# EAGLE design Teensy-Maxuino-Slave-DRV4835 (EAGLE 6.4)
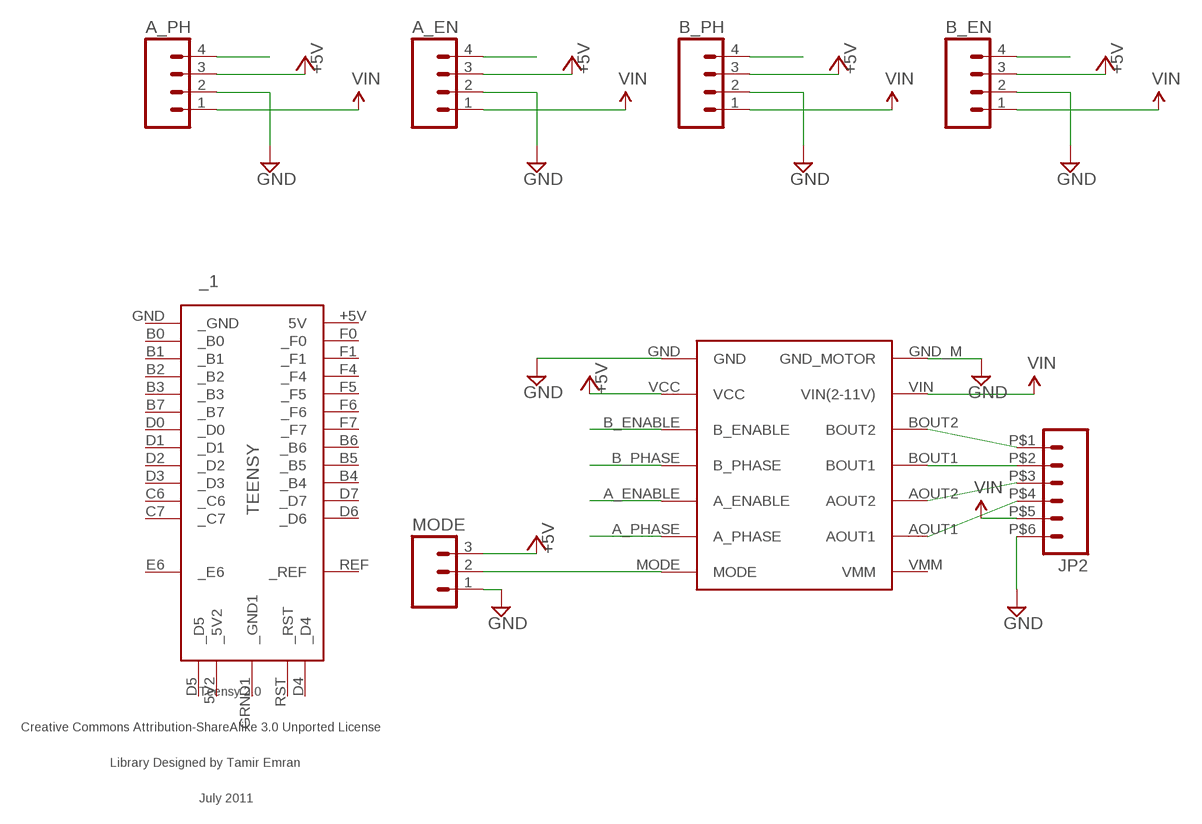
[diagram p0: schematic, sheet 1]

## Parts
_1  TEENSY  [TEENSY]
A_EN  M04PTH  [1X04]
A_PH  M04PTH  [1X04]
B_EN  M04PTH  [1X04]
B_PH  M04PTH  [1X04]
DRV8835  POLOLU_DRV8835  [POLOLU_DRV8835]
JP2  M06  [SPRINGTERMINAL-2.54MM-6]
MODE  M03PTH  [1X03]

## Nets
+5V: A_EN.3 A_PH.3 B_EN.3 B_PH.3 DRV8835.VCC MODE.3
A-ENABLE: A_EN.4 DRV8835.A_ENABLE
A-PHASE: A_PH.4 DRV8835.A_PHASE
ATTRU [GND]: A_EN.2 A_PH.2 B_EN.2 B_PH.2 DRV8835.GND DRV8835.GND_M(GND_MOTOR) JP2.P$6 MODE.1 ; supply symbol labelled GND
B-ENABLE: B_EN.4 DRV8835.B_ENABLE
B-PHASE: B_PH.4 DRV8835.B_PHASE
N$1: DRV8835.AOUT1 JP2.P$4
N$2: DRV8835.AOUT2 JP2.P$3
N$3: DRV8835.BOUT1 JP2.P$2
N$4: DRV8835.BOUT2 JP2.P$1
N$5: DRV8835.MODE MODE.2
VIN [Power]: A_EN.1 A_PH.1 B_EN.1 B_PH.1 DRV8835.VIN(VIN(2-11V)) JP2.P$5
Unconnected: _1.5V2(_5V2) _1.+5V(5V) _1.B0(_B0) _1.B1(_B1) _1.B2(_B2) _1.B3(_B3) _1.B4(_B4) _1.B5(_B5) _1.B6(_B6) _1.B7(_B7) _1.C6(_C6) _1.C7(_C7) _1.D0(_D0) _1.D1(_D1) _1.D2(_D2) _1.D3(_D3) _1.D4(_D4) _1.D5(_D5) _1.D6(_D6) _1.D7(_D7) _1.E6(_E6) _1.F0(_F0) _1.F1(_F1) _1.F4(_F4) _1.F5(_F5) _1.F6(_F6) _1.F7(_F7) _1.GND(_GND) _1.GRND1(_GND1) _1.REF(_REF) _1.RST(_RST) DRV8835.VMM

## Library data of the parts
_1 = aliEagleLib:TEENSY: Teensy 2.0 Original Design by Clint Fisher Modified Design by Tamir Emran Licensed Under Creative Commons Attribution-ShareAlike 3.0 Unported (CC BY-SA 3.0)
A_EN A_PH B_EN B_PH = SparkFun-Connectors:M04: Header 4 Standard 4-pin 0.1" header. Use with straight break away headers (SKU : PRT-00116), right angle break away headers (PRT-00553), swiss pins (PRT-00743), machine pins (PRT-00117), and female headers (PRT-00115). Molex polarized connector foot print use with SKU : PRT-08231 with associated crimp pins and housings. 1MM SMD Version SKU: PRT-10208
DRV8835 = aliEagleLib:POLOLU_DRV8835
JP2 = aliEagleLib:M06: Header 6 Standard 6-pin 0.1" header. Use with straight break away headers (SKU : PRT-00116), right angle break away headers (PRT-00553), swiss pins (PRT-00743), machine pins (PRT-00117), and female headers (PRT-00115). Molex polarized connector foot print use with SKU : PRT-08094 with associated crimp pins and housings. NOTES ON THE VARIANTS LOCK and LOCK_LONGPADS... This footprint was designed to help hold the alignment of a through-hole component (i.e. 6-pin header) while soldering it into place. You may notice that each hole has been shifted either up or down by 0.005 of an inch from it's more standard position (which is a perfectly straight line). This slight alteration caused the pins (the squares in the middle) to touch the edges of the holes. Because they are alternating, it causes a "brace" to hold the component in place. 0.005 has proven to be the perfect amount of "off-center" position when using our standard breakaway headers. Although looks a little odd when you look at the bare footprint, once you have a header in there, the alteration is very hard to notice. Also, if you push a header all the way into place, it is covered up entirely on the bottom side. This idea of altering the position of holes to aid alignment will be further integrated into the Sparkfun Library for other footprints. It can help hold any component with 3 or more connection pins.
MODE = SparkFun-Connectors:M03: Header 3 Standard 3-pin 0.1" header. Use with straight break away headers (SKU : PRT-00116), right angle break away headers (PRT-00553), swiss pins (PRT-00743), machine pins (PRT-00117), and female headers (PRT-00115). Molex polarized connector foot print use with SKU : PRT-08232 with associated crimp pins and housings.

## Net classes
0 default: width 0.152 mm, clearance 0.152 mm
1 GND: width 0.406 mm, clearance 0.152 mm
2 Power: width 0.406 mm, clearance 0.152 mm

## Board
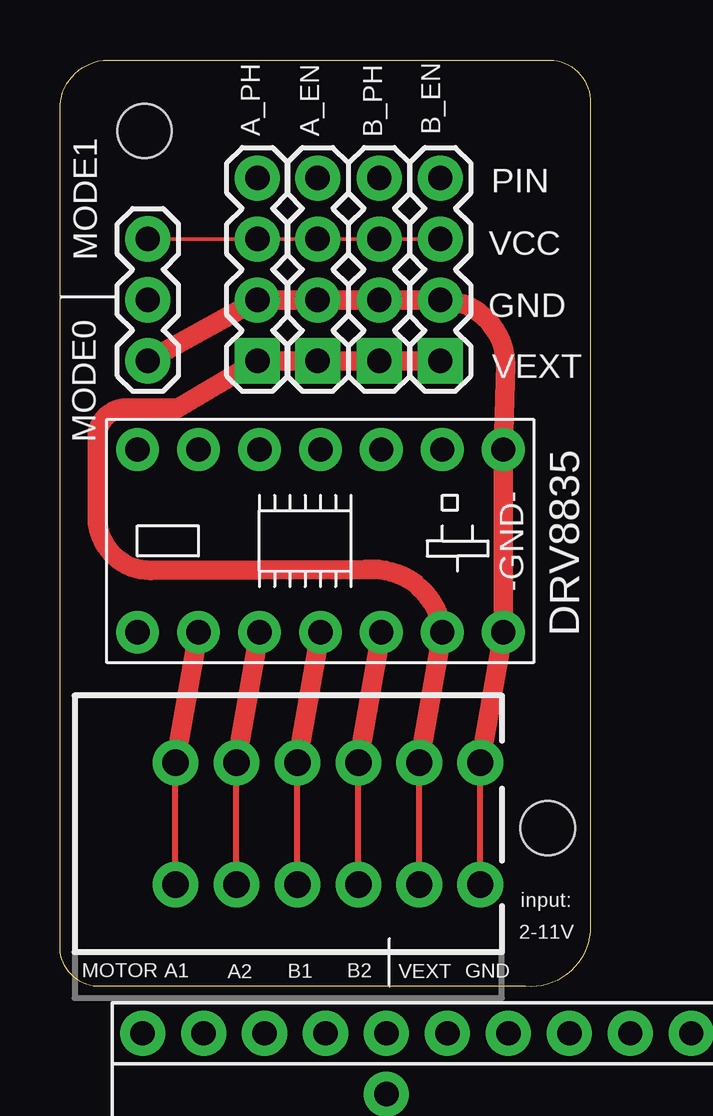
[diagram p1: board, top side]
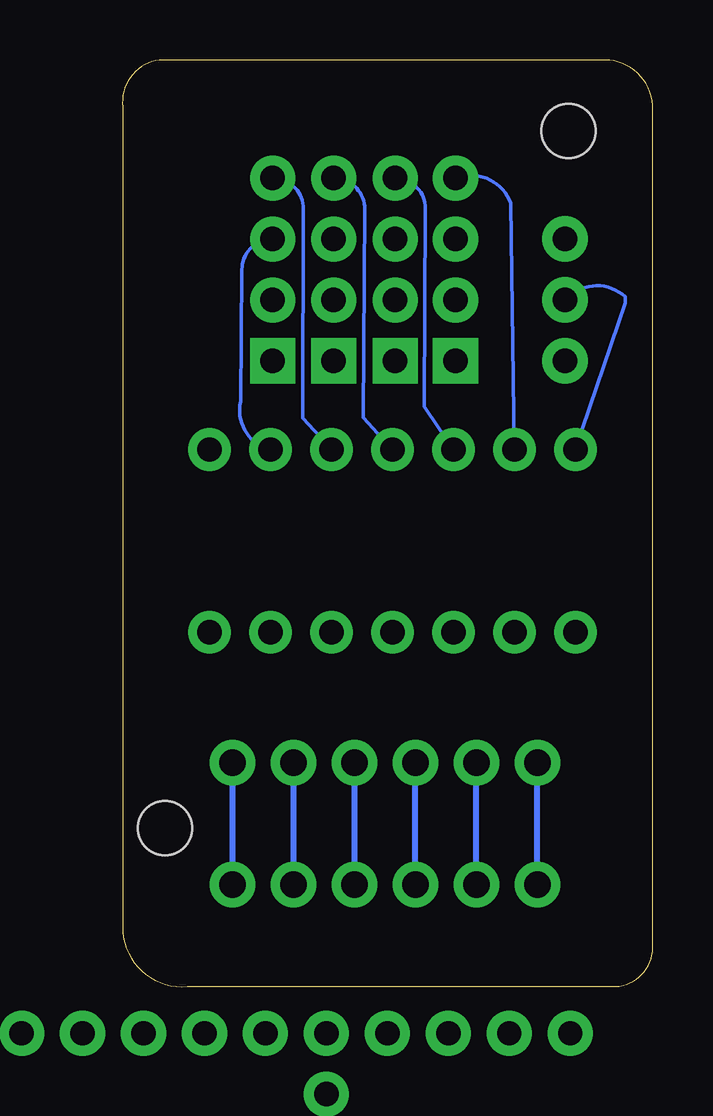
[diagram p2: board, bottom side, seen from below]

Size 22.1 x 38.63 mm. Coordinates in mm from the lower left corner, seen from the top.
Outline: 0,36.75 arc-90 2.18,38.63 20.56,38.62 arc-90 22.09,36.67 22.09,2.28 arc-90 19.4,0.01 1.54,0.01 arc-90 0,1.75 0,36.75
Copper layers (1*16): Top 0.035mm / dielectric 1.5mm / Bottom 0.035mm
Design rules "default *": minimum track width 6mil, minimum drill 24mil, track to track 6mil, track to pad 6mil, pad to pad 6mil, via to via 6mil, smd to smd 6mil, copper to edge 40mil, drill to drill 6mil, minimum pad ring 10mil, minimum via ring 8mil, stop-mask expansion 4mil, vias tented up to drill 0mil, thermal gap 10mil
Holes 2.26 mm at 3.52,35.67 20.32,6.61

### Footprints (pad centres in the part's own frame; a part is rotated, then mirrored left to right if it is on the bottom)
TEENSY = drill 1.016 pad 1.88: 5V2 13.97,-2.54; +5V -13.97,7.62; B0 -11.43,-7.62; B1 -8.89,-7.62; B2 -6.35,-7.62; B3 -3.81,-7.62; B4 8.89,7.62; B5 6.35,7.62; B6 3.81,7.62; B7 -1.27,-7.62; C6 11.43,-7.62; C7 13.97,-7.62; D0 1.27,-7.62; D1 3.81,-7.62; D2 6.35,-7.62; D3 8.89,-7.62; D4 13.97,5.08; D5 13.97,-5.08; D6 13.97,7.62; D7 11.43,7.62; E6 -3.81,-5.08; F0 -11.43,7.62; F1 -8.89,7.62; F4 -6.35,7.62; F5 -3.81,7.62; F6 -1.27,7.62; F7 1.27,7.62; GRND1 13.97,0; REF -3.81,5.08; RST 13.97,2.54 | drill 1.016 pad 1.88 square: GND -13.97,-7.62
1X04 = drill 1.016 pad 1.88 square: 1 0,0 | drill 1.016 pad 1.88: 2 2.54,0; 3 5.08,0; 4 7.62,0
POLOLU_DRV8835 = drill 1.016 pad 1.778: A_ENABLE -3.81,-3.81; A_PHASE -3.81,-6.35; AOUT1 3.81,-6.35; AOUT2 3.81,-3.81; B_ENABLE -3.81,1.27; B_PHASE -3.81,-1.27; BOUT1 3.81,-1.27; BOUT2 3.81,1.27; GND -3.81,6.35; GND_M 3.81,6.35; MODE -3.81,-8.89; VCC -3.81,3.81; VIN 3.81,3.81; VMM 3.81,-8.89
SPRINGTERMINAL-2.54MM-6 = drill 1.1 pad 1.9: 1 2.54,-2.54; 2 0,-2.54; 3 -2.54,-2.54; 4 -5.08,-2.54; 5 5.08,-2.54; 6 7.62,-2.54; P$1 2.54,2.54; P$2 0,2.54; P$3 -2.54,2.54; P$4 -5.08,2.54; P$5 5.08,2.54; P$6 7.62,2.54
1X03 = drill 1.016 pad 1.88: 1 0,0; 2 2.54,0; 3 5.08,0

### Placement (x,y rotation side)
_1  17.41,-9.56 0 top
A_EN  10.74,26.09 90 top
A_PH  8.22,26.09 90 top
B_EN  15.84,26.09 90 top
B_PH  13.3,26.09 90 top
DRV8835  12.12,18.58 270 top
JP2  9.89,6.79 0 top
MODE  3.66,26.09 90 top

### Tracks (layer width: path | path; a pad name or v marks a point on that pad's centre or on a via)
+5V
  Top 0.152: B_EN.3 B_PH.3 A_EN.3 A_PH.3 MODE.3
  Bottom 0.152: B_EN.3 arc-90 17.12,29.89 17.17,24.4 arc-90 DRV8835.VCC
A-ENABLE
  Bottom 0.152: A_EN.4 arc90 9.48,32.45 9.53,24.18 DRV8835.A_ENABLE
A-PHASE
  Bottom 0.152: A_PH.4 arc90 5.92,32.66 DRV8835.A_PHASE
ATTRU
  Top 0.813: MODE.1 A_PH.2 A_EN.2 B_PH.2 B_EN.2 arc-90 18.57,25.9 DRV8835.GND DRV8835.GND_M JP2.P$6
B-ENABLE
  Bottom 0.152: B_EN.4 arc90 14.56,32.43 14.58,23.7 DRV8835.B_ENABLE
B-PHASE
  Bottom 0.152: B_PH.4 arc90 12,32.41 12.06,23.71 DRV8835.B_PHASE
N$1
  Top 0.813: DRV8835.AOUT1 JP2.P$4
N$2
  Top 0.813: DRV8835.AOUT2 JP2.P$3
N$3
  Top 0.813: DRV8835.BOUT1 JP2.P$2
N$4
  Top 0.813: DRV8835.BOUT2 JP2.P$1
N$5
  Bottom 0.152: DRV8835.MODE 1.15,28.49 1.15,28.77 arc-90 MODE.2
VIN
  Top 0.813: B_EN.1 B_PH.1 A_EN.1 A_PH.1 4.92,24.12 2.77,24.12 arc90 1.55,22.9 1.55,19.59 arc90 3.78,17.36 12.74,17.38 arc-90 DRV8835.VIN JP2.P$5